# EAGLE schematic Comparator_1.1 (EAGLE 7.6.0)
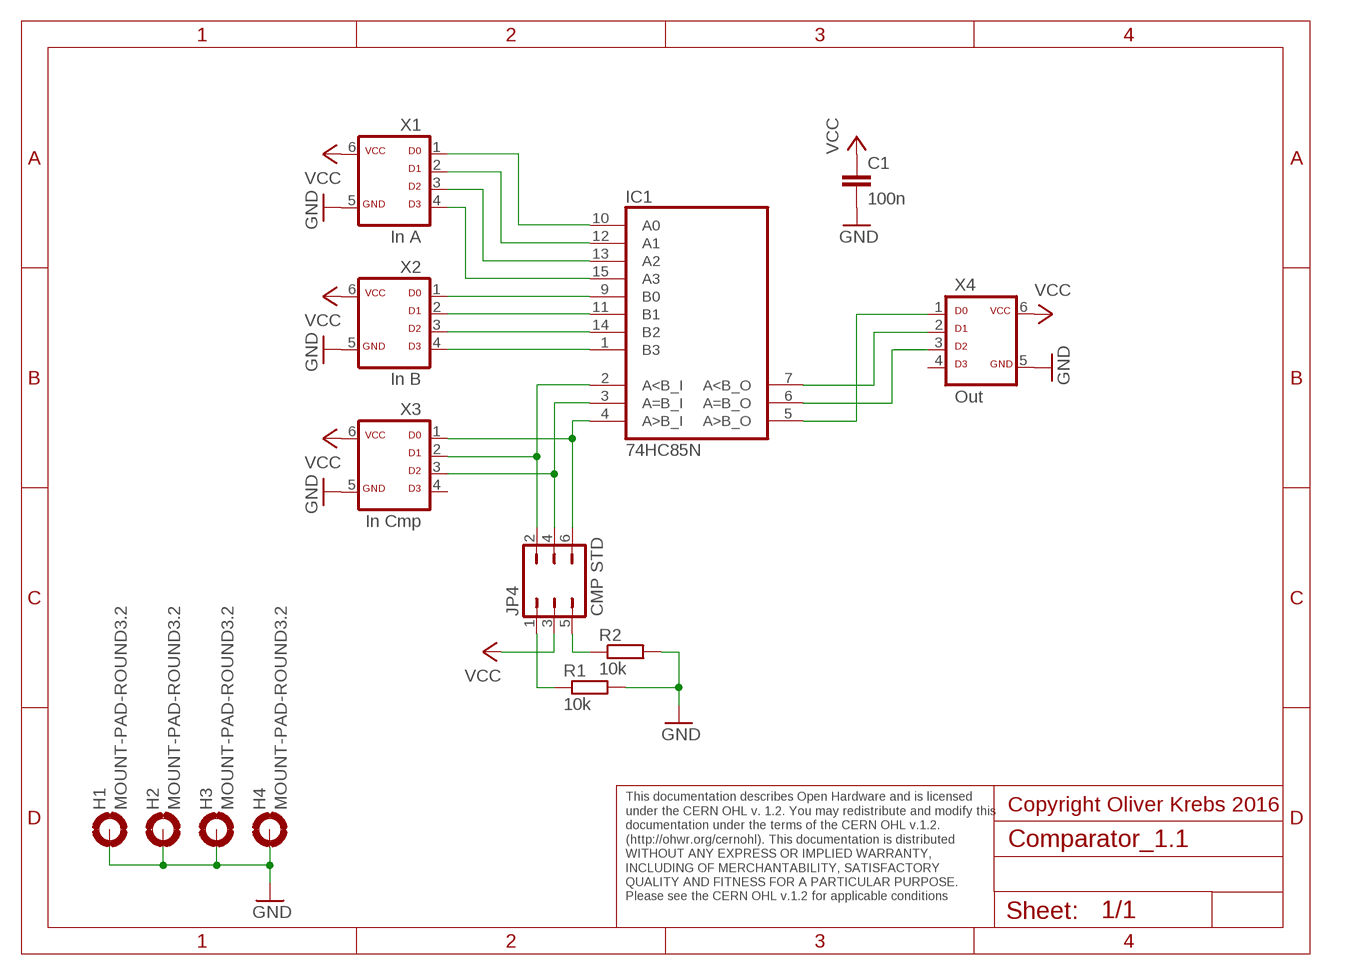
[diagram p0: schematic, sheet 1]

## Parts
C1  100n  C-EU050-025X075  [C050-025X075]
H1  MOUNT-PAD-ROUND3.2  [3,2-PAD]
H2  MOUNT-PAD-ROUND3.2  [3,2-PAD]
H3  MOUNT-PAD-ROUND3.2  [3,2-PAD]
H4  MOUNT-PAD-ROUND3.2  [3,2-PAD]
IC1  74HC85N  [DIL16]
JP4  CMP STD  JP3Q  [JP3Q]
R1  10k  R-EU_0207/10  [0207/10]
R2  10k  R-EU_0207/10  [0207/10]
X1  In A  ML6D  [ML-6]
X2  In B  ML6D  [ML-6]
X3  In Cmp  ML6D  [ML-6]
X4  Out  ML6D  [ML-6]

## Nets
GND: C1.2 H1.B3,2(MOUNT) H2.B3,2(MOUNT) H3.B3,2(MOUNT) H4.B3,2(MOUNT) R1.2 R2.2 X1.5 X2.5 X3.5 X4.5
N$1: IC1.10(A0) X1.1
N$2: IC1.12(A1) X1.2
N$3: IC1.13(A2) X1.3
N$4: IC1.15(A3) X1.4
N$5: IC1.9(B0) X2.1
N$6: IC1.11(B1) X2.2
N$7: IC1.14(B2) X2.3
N$8: IC1.1(B3) X2.4
N$9: IC1.3(A=B_I) JP4.4 X3.3
N$10: IC1.2(A<B_I) JP4.2 X3.2
N$11: IC1.4(A>B_I) JP4.6 X3.1
N$12: IC1.5(A>B_O) X4.1
N$13: IC1.7(A<B_O) X4.2
N$14: IC1.6(A=B_O) X4.3
N$16: JP4.1 R1.1
N$18: JP4.5 R2.1
VCC: C1.1 JP4.3 X1.6 X2.6 X3.6 X4.6
Unconnected: X3.4 X4.4

## Notes on the sheet
- Copyright Oliver Krebs 2016
- This documentation describes Open Hardware and is licensed 
  under the CERN OHL v. 1.2. You may redistribute and modify this 
  documentation under the terms of the CERN OHL v.1.2. 
  (http://ohwr.org/cernohl). This documentation is distributed
  WITHOUT ANY EXPRESS OR IMPLIED WARRANTY, 
  INCLUDING OF MERCHANTABILITY, SATISFACTORY 
  QUALITY AND FITNESS FOR A PARTICULAR PURPOSE. 
  Please see the CERN OHL v.1.2 for applicable conditions

## Power pins joined to a net without a drawn wire
GND: IC1.8(GND)
VCC: IC1.16(VCC)

## Library data of the parts
C1 = 01-my_rcl:C-EU: CAPACITOR, European symbol
H1-H4 = holes:MOUNT-PAD-ROUND: MOUNTING PAD, round
IC1 = 74xx-eu:74*85: 4-bit magnitude COMPARATOR
JP4 = 01-my-con:JP3Q
R1 R2 = 01-my_rcl:R-EU_: RESISTOR, European symbol
X1-X4 = 01-my-con:ML6D